# EAGLE design EncoderR1 (EAGLE 9.5.2)
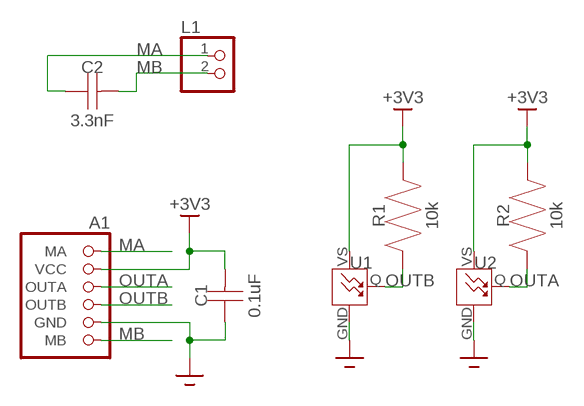
[diagram p0: schematic, sheet 1]

## Parts
A1  ENCODER  [ENCODER-TAB]
C1  0.1uF  CAPACITOR0603  [0603]
C2  3.3nF  CAPACITOR0603  [0603]
L1  MOTOR  [MOTOR]
R1  10k  RESISTOR0603  [0603]
R2  10k  RESISTOR0603  [0603]
U1  TLE49462KHTSA1  [TLE49462KHTSA1]
U2  TLE49462KHTSA1  [TLE49462KHTSA1]

## Nets
+3V3: A1.2(VCC) C1.2 R1.2 R2.2 U1.VS U2.VS
GND: A1.5(GND) C1.1 U1.GND U2.GND
MA: A1.1(MA) C2.1 L1.1
MB: A1.6(MB) C2.2 L1.2
OUTA: A1.3(OUTA) R2.1 U2.Q
OUTB: A1.4(OUTB) R1.1 U1.Q

## Library data of the parts
A1 = Micromouse 2020:ENCODER
C1 C2 = Micromouse 2020:CAPACITOR
L1 = Micromouse 2020:MOTOR
R1 R2 = Micromouse 2020:RESISTOR
U1 U2 = Micromouse 2020:TLE49462KHTSA1

## Board
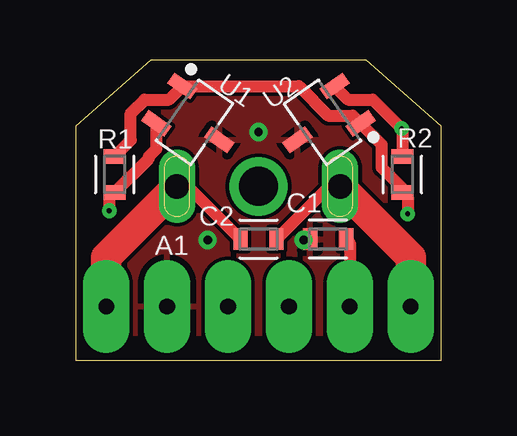
[diagram p1: board, top side]
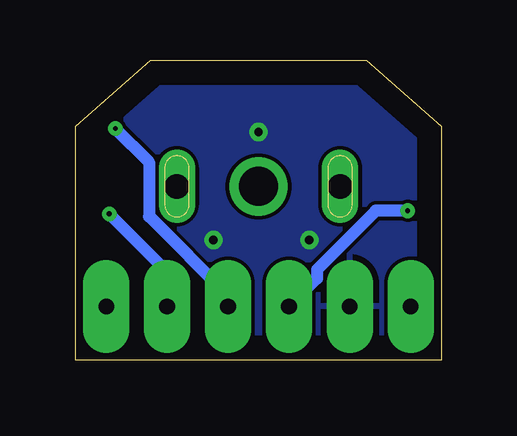
[diagram p2: board, bottom side, seen from below]

Size 15.24 x 12.5 mm. Coordinates in mm from the lower left corner, seen from the top.
Outline: 0,0 15.24,0 15.24,9.73 12.12,12.5 3.12,12.5 0,9.73 0,0
Copper layers (1*16): Top 0.035mm / dielectric 1.5mm / Bottom 0.035mm
Design rules "default *": minimum track width 6mil, minimum drill 0.2mm, track to track 6mil, track to pad 6mil, pad to pad 6mil, via to via 6mil, smd to smd 6mil, copper to edge 40mil, drill to drill 6mil, minimum pad ring 10mil, minimum via ring 8mil, stop-mask expansion 4mil, vias tented up to drill 0mil, thermal gap 10mil

### Footprints (pad centres in the part's own frame; a part is rotated, then mirrored left to right if it is on the bottom)
ENCODER-TAB = drill 0.65 pad 1.93 long: 1 -6.35,0; 2 -3.81,0; 3 -1.27,0; 4 1.27,0; 5 3.81,0; 6 6.35,0
0603 = smd 0.6 x 0.9: 1 -0.75,0; 2 0.75,0
MOTOR = drill 1.02 long: 1 -3.4,0; 2 3.4,0 | drill 1.62 pad 1.7: 3 0,0
TLE49462KHTSA1 = smd 1.171 x 0.547: GND 1.275,0; Q -1.275,-0.95; VS -1.275,0.95

### Placement (x,y rotation side)
A1  7.62,2.24 180 top
C1  10.52,5.04 0 top
C2  7.62,5.04 180 top
L1  7.62,7.24 180 top
R1  1.62,7.74 90 top
R2  13.62,7.74 270 top
U1  4.95,9.91 325 top
U2  10.29,9.91 215 top

### Tracks (layer width: path | path; a pad name or v marks a point on that pad's centre or on a via)
+3V3  (via drill 0.2)
  Top 0.508: C1.2 11.43,4.88 A1.2 | R1.2 2.29,9.16 2.29,10.28 2.86,10.85 3.88,10.85 U1.VS 9.3,11.41 10.53,10.19 11.55,10.19 U2.VS 12.76,8.97 12.76,8.02 13.62,7.16 R2.2 13.84,6.76 v13.84,6.09
  Bottom 0.508: v13.84,6.09 11.43,3.68 A1.2
GND  (via drill 0.35)
  Top 0.254: C1.1 9.77,5 v9.5,5
  other vias: 7.62,9.5 5.5,5
  pour Top: 0,0 0,12.5 11.5,12.5 15.24,12.5 15.24,0
  pour Bottom: 0,0 0,12.5 15.24,12.5 15.24,0
MA
  Top 0.508: C2.1 10.57,7.24 L1.1
  Top 1.27: A1.1 13.97,4.29 L1.1
MB
  Top 0.508: C2.2 4.67,7.24 L1.2
  Top 1.27: A1.6 1.27,4.29 L1.2
OUTA  (via drill 0.2)
  Top 0.508: U2.Q 11.36,10.85 12.39,10.85 v13.59,9.65 13.62,9.62 R2.1
  Bottom 0.508: v13.59,9.65 12.19,8.25 12.19,5.99 8.89,2.68 A1.3
OUTB  (via drill 0.2)
  Top 0.508: U1.Q 3.36,8.8 3.05,8.48 3.05,8.41 R1.1 1.4,6.76 v1.4,6.22
  Bottom 0.508: A1.4 5.18,3.4 5.18,3.77 2.73,6.22 v1.4,6.22